# Altium schematic sheet On_Off.SchDoc: ON / OFF Controller
size A3; DocumentNumber: 3; SheetNumber: 3; SheetTotal: 20
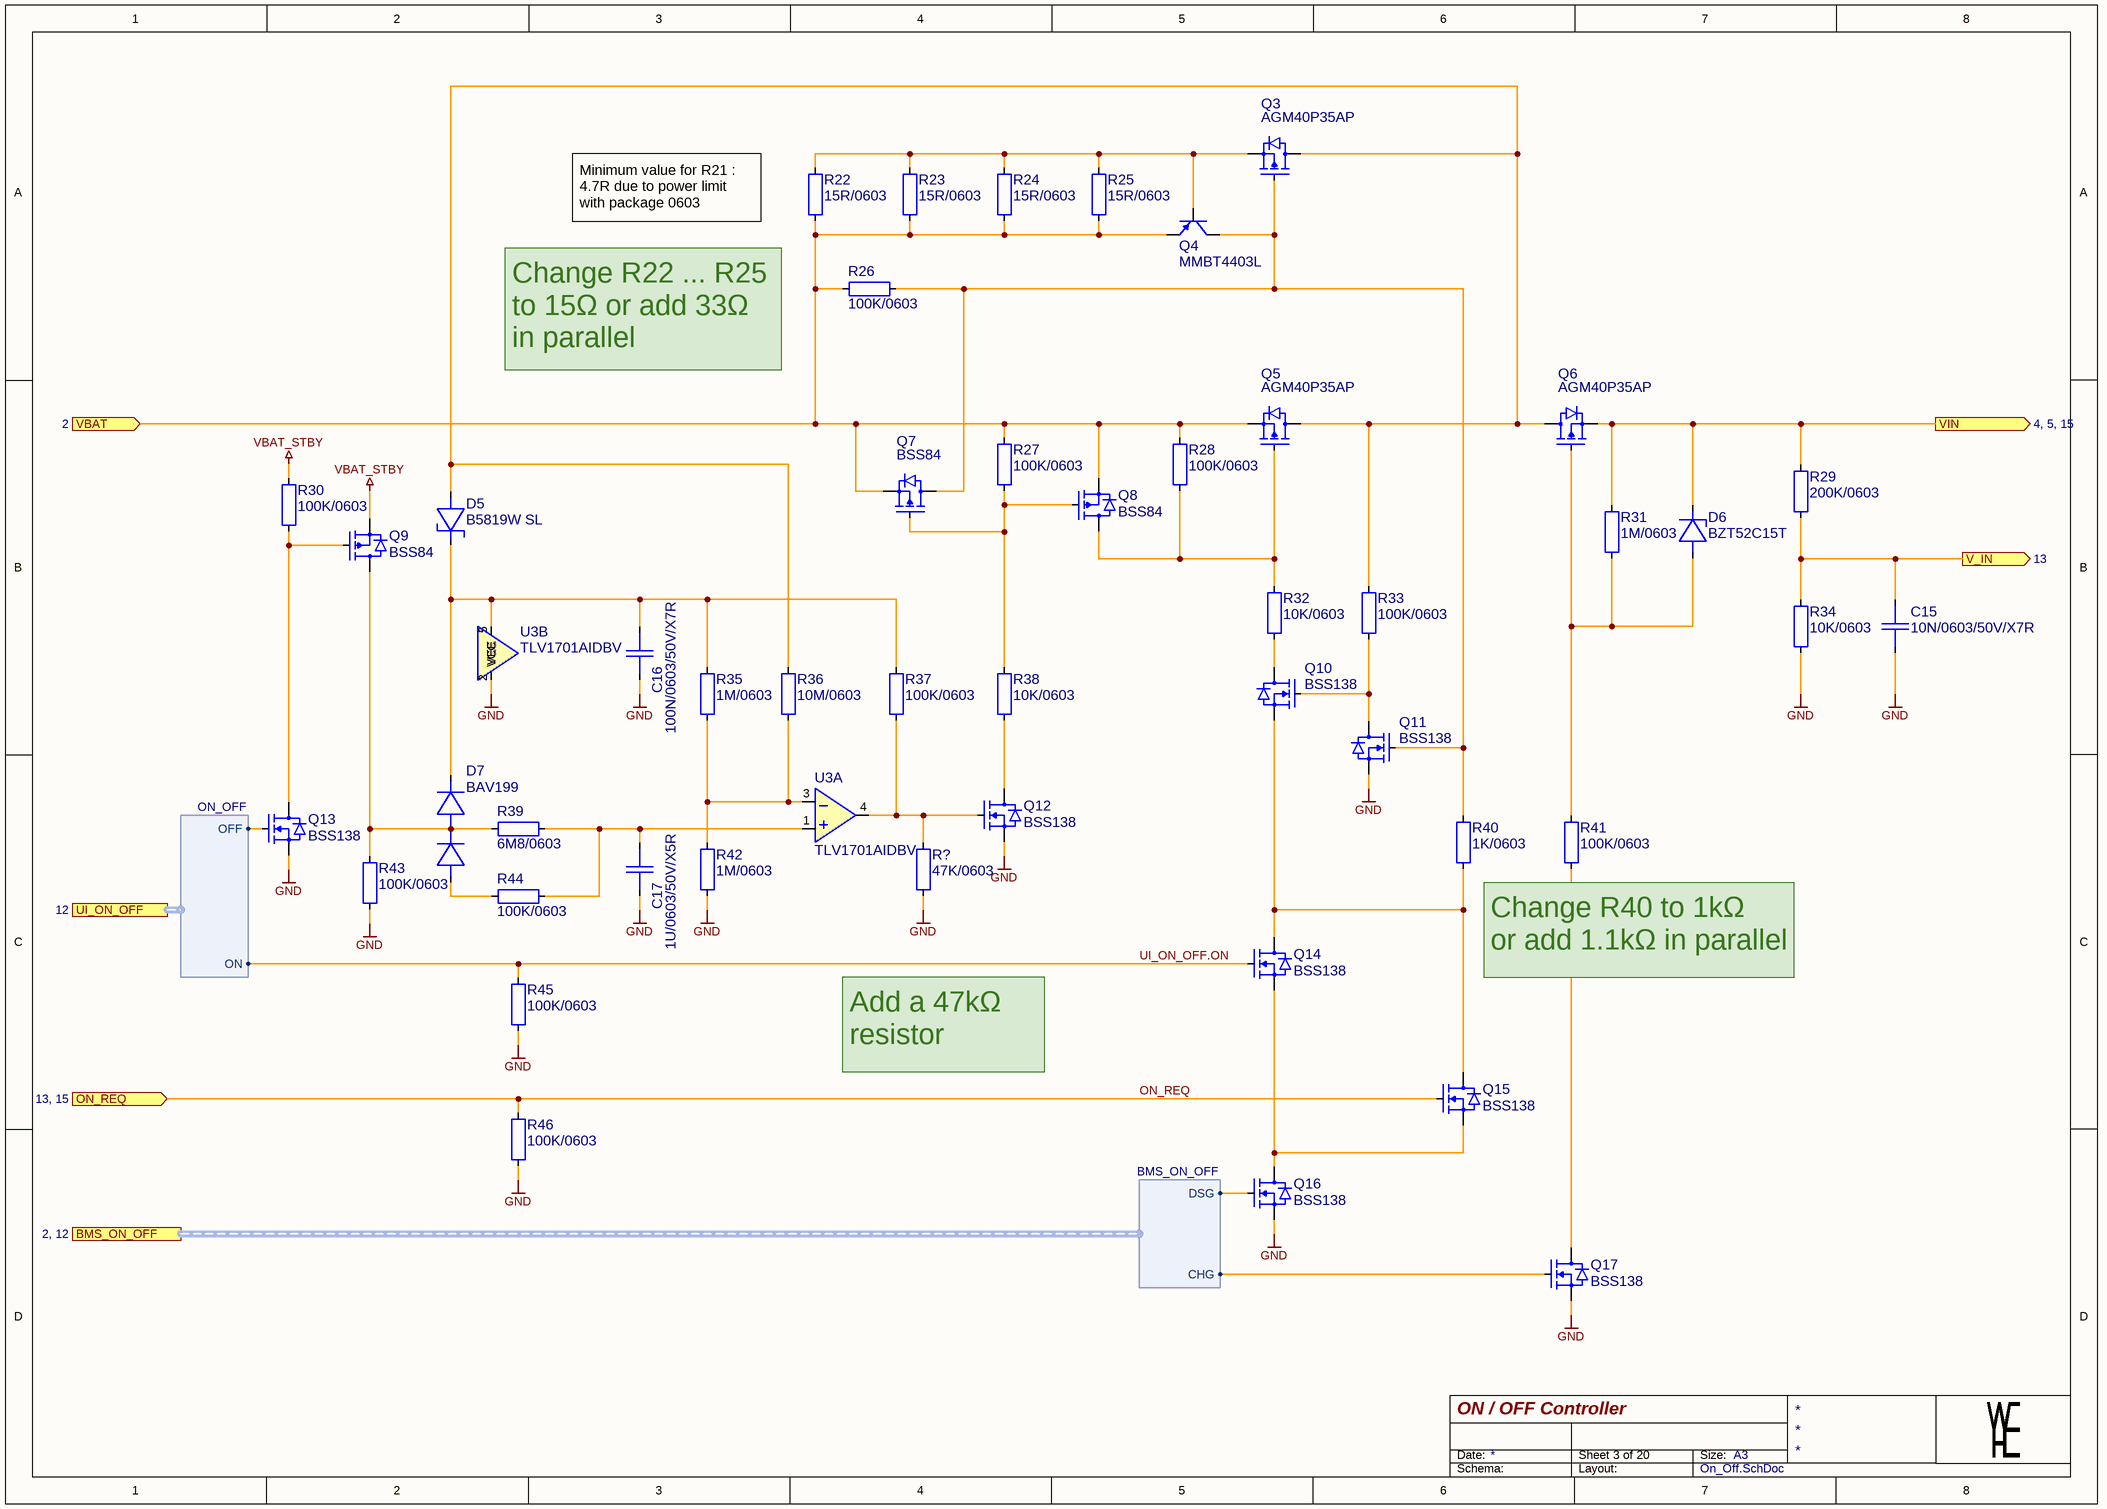
[diagram p0: On_Off.SchDoc]

## Parts
C15  10N/0603/50V/X7R  [CAP0603_X7R]
C16  100N/0603/50V/X7R  [CAP0603_X7R]
C17  1U/0603/50V/X5R  [CAP0603_X7R]
D5  B5819W SL  [SOD3718X125]
D6  BZT52C15T  [SOD1608X065]
D7  BAV199  [SOT2395P280X125-3-SE]
Q3  AGM40P35AP  [SON065P330X330X075-5-TH245X175]
Q4  MMBT4403L  [SOT2395P280X125-3-SE]
Q5  AGM40P35AP  [SON065P330X330X075-5-TH245X175]
Q6  AGM40P35AP  [SON065P330X330X075-5-TH245X175]
Q7  BSS84  [SOT2395P280X125-3-SE]
Q8  BSS84  [SOT2395P280X125-3-SE]
Q9  BSS84  [SOT2395P280X125-3-SE]
Q10  BSS138  [SOT2395P280X125-3-SE]
Q11  BSS138  [SOT2395P280X125-3-SE]
Q12  BSS138  [SOT2395P280X125-3-SE]
Q13  BSS138  [SOT2395P280X125-3-SE]
Q14  BSS138  [SOT2395P280X125-3-SE]
Q15  BSS138  [SOT2395P280X125-3-SE]
Q16  BSS138  [SOT2395P280X125-3-SE]
Q17  BSS138  [SOT2395P280X125-3-SE]
R22  15R/0603  [R0603-0.40-WW]
R23  15R/0603  [R0603-0.40-WW]
R24  15R/0603  [R0603-0.40-WW]
R25  15R/0603  [R0603-0.40-WW]
R26  100K/0603  [R0603-0.40-WW]
R27  100K/0603  [R0603-0.40-WW]
R28  100K/0603  [R0603-0.40-WW]
R29  200K/0603  [R0603-0.40-WW]
R30  100K/0603  [R0603-0.40-WW]
R31  1M/0603  [R0603-0.40-WW]
R32  10K/0603  [R0603-0.40-WW]
R33  100K/0603  [R0603-0.40-WW]
R34  10K/0603  [R0603-0.40-WW]
R35  1M/0603  [R0603-0.40-WW]
R36  10M/0603  [R0603-0.40-WW]
R37  100K/0603  [R0603-0.40-WW]
R38  10K/0603  [R0603-0.40-WW]
R39  6M8/0603  [R0603-0.40-WW]
R40  1K/0603  [R0603-0.40-WW]
R41  100K/0603  [R0603-0.40-WW]
R42  1M/0603  [R0603-0.40-WW]
R43  100K/0603  [R0603-0.40-WW]
R44  100K/0603  [R0603-0.40-WW]
R45  100K/0603  [R0603-0.40-WW]
R46  100K/0603  [R0603-0.40-WW]
R?  47K/0603  [R0603-0.40-WW]
U3  TLV1701AIDBV  [SOT2395P280X125-5-NW]  (parts A,B of 2)

## Ports
BMS_ON_OFF (harness BMS_ON_OFF, see 2, 12), ON_REQ (in, see 13, 15), UI_ON_OFF (harness ON_OFF, see 12), V_IN (out, see 13), VBAT (in, see 2), VIN (out, see 4, 5, 15)

## Harnesses
ON_OFF: OFF, ON
BMS_ON_OFF: CHG, DSG

## Nets
GND: C15.2 C16.2 C17.2 Q11.2(SOURCE) Q12.2(SOURCE) Q13.2(SOURCE) Q16.2(SOURCE) Q17.2(SOURCE) R34.2 R42.2 R43.2 R45.2 R46.2 R?.2 U3.2(VEE)
VBAT_STBY: Q9.2(SOURCE) R30.1
ON_REQ: Q15.1(GATE) R46.1 ; port ON_REQ
UI_ON_OFF.ON: Q14.1(GATE) R45.1 ; port UI_ON_OFF.ON
V_IN: C15.1 R29.2 R34.1 ; port V_IN
VBAT: Q4.2(EMITTER) Q5.1,2,3(SOURCE) Q7.2(SOURCE) Q8.2(SOURCE) R22.1 R23.1 R24.1 R25.1 R26.1 R27.1 R28.1 ; port VBAT
VIN: D6.1(C) Q6.1,2,3(SOURCE) R29.1 R31.1 ; port VIN
NetC16_1: C16.1 D5.1(C) D7.2(K2) R35.1 R37.1 U3.5(VCC)
NetC17_1: C17.1 R39.2 R44.2 U3.1(IN+)
NetD5_2: D5.2(A) Q3.5(DRAIN) Q5.5(DRAIN) Q6.5(DRAIN) R33.1 R36.1
NetD6_2: D6.2(A) Q6.4(GATE) R31.2 R41.1
NetD7_1: D7.1(A1) R44.1
NetD7_3: D7.3(K1/A2) Q9.3(DRAIN) R39.1 R43.1
NetQ3_1,2,3: Q3.1,2,3(SOURCE) Q4.1(BASE) R22.2 R23.2 R24.2 R25.2
NetQ3_4: Q3.4(GATE) Q4.3(COLLECTOR) Q7.3(DRAIN) Q11.1(GATE) R26.2 R40.1
NetQ5_4: Q5.4(GATE) Q8.3(DRAIN) R28.2 R32.1
NetQ7_1: Q7.1(GATE) Q8.1(GATE) R27.2 R38.1
NetQ9_1: Q9.1(GATE) Q13.3(DRAIN) R30.2
NetQ10_1: Q10.1(GATE) Q11.3(DRAIN) R33.2
NetQ10_2: Q10.2(SOURCE) Q14.3(DRAIN) Q15.3(DRAIN) R40.2
NetQ10_3: Q10.3(DRAIN) R32.2
NetQ12_1: Q12.1(GATE) R37.2 R?.1 U3.4(OUT)
NetQ12_3: Q12.3(DRAIN) R38.2
NetQ13_1: Q13.1(GATE) ; port UI_ON_OFF.OFF
NetQ14_2: Q14.2(SOURCE) Q15.2(SOURCE) Q16.3(DRAIN)
NetQ16_1: Q16.1(GATE) ; port BMS_ON_OFF.DSG
NetQ17_1: Q17.1(GATE) ; port BMS_ON_OFF.CHG
NetQ17_3: Q17.3(DRAIN) R41.2
NetR35_2: R35.2 R36.2 R42.1 U3.3(IN-)

## Notes on the sheet
- Minimum value for R21 :
  4.7R due to power limit with package 0603
- Change R22 ... R25 to 15Ω or add 33Ω in parallel
- Change R40 to 1kΩ
  or add 1.1kΩ in parallel
- Add a 47kΩ resistor
- Date:
- Size:
- A3
- Schema:
- Layout:

## Library data of the parts
C15 = 10N/0603/50V/X7R: CAP SM 0603 10nF 50V X7R; Manufacturer: GENERIC; Manufacturer 1: YAGEO; Manufacturer Part Number 1: CC0603KPX7R9BB103; Absolute Value: 1E-8; Eurocircuits GPN: GPC0603103; Part Number: 10N/0603/50V/X7R; Package: 0603; Value: 10nF; HelpURL: https://www.yageo.com/upload/media/product/app/datasheet/mlcc/upy-gphc_x7r_6_3v-to-250v.pdf; Supplier 1: Digi-Key; Supplier Part Number 1: 311-1572-1-ND; Manufacturer 2: YAGEO; Manufacturer Part Number 2: CC0603KRX7R9BB103; Supplier 2: Digi-Key; Supplier Part Number 2: 311-1085-1-ND; Manufacturer Part Number 3: CC0603KRX7R9BB103; Supplier 3: LCSC; Supplier Part Number 3: C100042
C16 = 100N/0603/50V/X7R: CAP SM 0603 100nF 50V X7R; Manufacturer: GENERIC; Manufacturer 1: YAGEO; Manufacturer Part Number 1: CC0603KPX7R9BB104; Absolute Value: 1E-7; Eurocircuits GPN: GPC0603104; Part Number: 100N/0603/50V/X7R; Package: 0603; Value: 100nF; HelpURL: https://www.yageo.com/upload/media/product/app/datasheet/mlcc/upy-gphc_x7r_6_3v-to-250v.pdf; Supplier 1: Digi-Key; Supplier Part Number 1: 311-3567-1-ND; Supplier 3: LCSC; Supplier Part Number 3: C14663; Manufacturer 2: YAGEO; Manufacturer Part Number 2: CC0603MRX7R9BB104; Supplier 2: Digi-Key; Supplier Part Number 2: 311-4110-1-ND; JLC Type: Basic; Manufacturer Part Number 3: CC0603KRX7R9BB104
C17 = 1U/0603/50V/X5R: CAP SM 0603 1.0uF 50V X5R; Manufacturer: GENERIC; Manufacturer 1: Samsung Electro-Mechanics; Manufacturer Part Number 1: CL10A105KB8NNNC; Absolute Value: 1E-6; Eurocircuits GPN: GPC0603105-X5R; Part Number: 1U/0603/50V/X5R; Package: 0603; Value: 1.0uF; HelpURL: https://mm.digikey.com/Volume0/opasdata/d220001/medias/docus/658/CL10A105KB8NNNC_Spec.pdf; Supplier 1: Digi-Key; Supplier Part Number 1: 1276-1860-1-ND; Manufacturer Part Number 3: CL10A105KB8NNNC; Supplier 3: LCSC; Supplier Part Number 3: C15849; JLC Type: Basic
D5 = B5819W SL: 40V 600mV@1A 1A SOD-123 Schottky Barrier Diodes; Manufacturer: GENERIC; Manufacturer 1: SMC Diode Solutions; Part Number: B5819W SL; Package: SOD-123; Value: B5819W SL; Absolute Value: 40V; HelpURL: https://datasheet.lcsc.com/lcsc/2304140030_Jiangsu-Changjing-Electronics-Technology-Co---Ltd--B5819W-SL_C8598.pdf; Manufacturer 3: Jiangsu Changjing Electronics Technology Co., Ltd.; Manufacturer Part Number 3: B5819W SL; Supplier 3: LCSC; Supplier Part Number 3: C8598; JLC Type: Basic; Manufacturer Part Number 1: B5819WSL; Supplier 1: Digikey; Supplier Part Number 1: 1655-B5819WSLCT-ND
D6 = BZT52C15T: DIODE ZENER 15V 100MW SOD523; Manufacturer: Micro Commercial Co; Manufacturer Part Number 1: BZT52C15T-TP; Part Number: BZT52C15T; Package: SC-79, SOD-523; Value: BZT52C15T; Absolute Value: 15 V; HelpURL: https://www.mccsemi.com/pdf/Products/BZT52C(B)2V4T-BZT52C(B)39T(SOD-523).pdf; Manufacturer 1: Micro Commercial Co; Supplier 1: Digikey; Supplier Part Number 1: BZT52C15T-TPMSCT-ND; Manufacturer 2: Diodes Incorporated; Manufacturer Part Number 2: BZT52C15T-7; Supplier 2: Digikey; Supplier Part Number 2: BZT52C15T-7DICT-ND; Manufacturer 3: Diodes Incorporated; Manufacturer Part Number 3: BZT52C15T-7; Supplier 3: LCSC; Supplier Part Number 3: C460787
D7 = BAV199: Silicon Low Leakage Diode 85V; Manufacturer: Infineon Technologies; Manufacturer Part Number 1: BAV199E6433HTMA1; Part Number: BAV199; Package: SOT23; Value: BAV199; Absolute Value: 85V; HelpURL: https://www.infineon.com/dgdl/bav199series.pdf?folderId=db3a30431400ef6801141c748874044e&fileId=db3a30431400ef6801141cba733104e5; Manufacturer 1: Infineon Technologies; Supplier 1: Digikey; Supplier Part Number 1: BAV199E6433HTMA1CT-ND; Manufacturer 3: LRC; Manufacturer Part Number 3: LBAV199LT1G; Supplier 3: LCSC; Supplier Part Number 3: C12740
Q3 Q5 Q6 = AGM40P35AP: 40V 35A 11mΩ@10V,15A 30W 1.7V 1 piece P-channel PDFN(3.3x3.3) MOSFETs ROHS; Manufacturer: AGM-Semi; Part Number: AGM40P35AP; Package: 8-PowerVDFN; HelpURL: https://www.lcsc.com/datasheet/lcsc_datasheet_2504101957_AGM-Semi-AGM40P35AP_C18221399.pdf; Manufacturer 3: AGM-Semi; Manufacturer Part Number 3: AGM40P35AP; Supplier 3: LCSC; Supplier Part Number 3: C18221399
Q4 = MMBT4403L: Switching Transistor PNP Silicon; Manufacturer: ON SEMI; Part Number: MMBT4403L; Package: SOT23; HelpURL: https://www.onsemi.com/pdf/datasheet/mmbt4403lt1-d.pdf; Manufacturer 3: ONSEMI; Manufacturer Part Number 3: MMBT4403LT1G; Supplier 3: LCSC; Supplier Part Number 3: C78864; JLC Type: Extended
Q7-Q9 = BSS84: 50V P-Channel MOSFET; Manufacturer: GENERIC; Manufacturer 1: Good-Ark Semiconductor; Part Number: BSS84; Package: SOT23; HelpURL: https://goodarksemi.com/docs/datasheets/mosfets/BSS84.pdf; Manufacturer Part Number 1: BSS84; Supplier 1: Digi-Key; Supplier Part Number 1: 4786-BSS84CT-ND; Manufacturer 3: Jiangsu Changjing Electronics Technology Co., Ltd.; Manufacturer Part Number 3: BSS84; Supplier 3: LCSC; Supplier Part Number 3: C114481; JLC Type: Extended; Manufacturer 2: LRC; Manufacturer Part Number 2: LBSS84LT1G; Supplier 2: LCSC; Supplier Part Number 2: C8492
Q10-Q17 = BSS138: N-Kanal 50 V 220mA (Ta) 350mW (Ta) Oberflächenmontage SOT-23; Manufacturer: GENERIC; Manufacturer 1: ANBON SEMICONDUCTOR (INT'L) LIMITED; Part Number: BSS138; Package: SOT23; HelpURL: https://mm.digikey.com/Volume0/opasdata/d220001/medias/docus/3037/BSS138.pdf; Manufacturer Part Number 1: BSS138; Supplier 1: Digi-Key; Supplier Part Number 1: 4530-BSS138CT-ND; Manufacturer 3: FOSAN; Manufacturer Part Number 3: BSS138; Supplier 3: LCSC; Supplier Part Number 3: C2926186; JLC Type: Extended; Manufacturer 2: FOSAN; Manufacturer Part Number 2: BSS138; Supplier 2: LCSC; Supplier Part Number 2: C2926186
R22-R25 = 15R/0603: RES SM 0603 15R; Manufacturer: GENERIC; Manufacturer 1: YAGEO; Manufacturer Part Number 1: RC0603FR-1315RL; Absolute Value: 15; Eurocircuits GPN: GPR060315R; Part Number: 15R/0603; Package: 0603; Value: 15R; HelpURL: https://www.yageogroup.com/content/datasheet/asset/file/PYU-RC_GROUP_51_ROHS_L; Supplier 1: Digi-Key; Supplier Part Number 1: 13-RC0603FR-1315RLCT-ND; Manufacturer 2: YAGEO; Manufacturer Part Number 2: RC0603FR-1015RL; Supplier 2: Digi-Key; Supplier Part Number 2: 13-RC0603FR-1015RLCT-ND
R26-R28 R30 R33 R37 R41 R43-R46 = 100K/0603: RES SM 0603 100K; Manufacturer: GENERIC; Manufacturer 1: YAGEO; Manufacturer Part Number 1: RC0603FR-13100KL; Absolute Value: 100000; Eurocircuits GPN: GPR0603100K; Part Number: 100K/0603; Package: 0603; Value: 100K; HelpURL: https://www.yageogroup.com/content/datasheet/asset/file/PYU-RC_GROUP_51_ROHS_L; Supplier 1: Digi-Key; Supplier Part Number 1: 13-RC0603FR-13100KLCT-ND; Manufacturer 2: YAGEO; Manufacturer Part Number 2: RC0603FR-10100KL; Supplier 2: Digi-Key; Supplier Part Number 2: 13-RC0603FR-10100KLCT-ND; Manufacturer 3: UNI-ROYAL(Uniroyal Elec); Manufacturer Part Number 3: 0603WAF1003T5E; Supplier 3: LCSC; Supplier Part Number 3: C25803; JLC Type: Basic
R29 = 200K/0603: RES SM 0603 200K; Manufacturer: GENERIC; Manufacturer 1: YAGEO; Manufacturer Part Number 1: RC0603FR-13200KL; Absolute Value: 200000; Eurocircuits GPN: GPR0603200K; Part Number: 200K/0603; Package: 0603; Value: 200K; HelpURL: https://www.yageogroup.com/content/datasheet/asset/file/PYU-RC_GROUP_51_ROHS_L; Supplier 1: Digi-Key; Supplier Part Number 1: 13-RC0603FR-13200KLCT-ND; Manufacturer 2: YAGEO; Manufacturer Part Number 2: RC0603FR-10200KL; Supplier 2: Digi-Key; Supplier Part Number 2: 13-RC0603FR-10200KLCT-ND; JLC Type: Basic; Manufacturer 3: UNI-ROYAL(Uniroyal Elec); Manufacturer Part Number 3: 0603WAF2003T5E; Supplier 3: LCSC; Supplier Part Number 3: C25811
R31 R35 R42 = 1M/0603: RES SM 0603 1M; Manufacturer: GENERIC; Manufacturer 1: YAGEO; Manufacturer Part Number 1: RC0603FR-131ML; Absolute Value: 1000000; Eurocircuits GPN: GPR06031M; Part Number: 1M/0603; Package: 0603; Value: 1M; HelpURL: https://www.yageogroup.com/content/datasheet/asset/file/PYU-RC_GROUP_51_ROHS_L; Supplier 1: Digi-Key; Supplier Part Number 1: 13-RC0603FR-131MLCT-ND; Manufacturer 2: YAGEO; Manufacturer Part Number 2: RC0603FR-101ML; Supplier 2: Digi-Key; Supplier Part Number 2: 13-RC0603FR-101MLCT-ND; Manufacturer 3: UNI-ROYAL(Uniroyal Elec); Manufacturer Part Number 3: 0603WAF1004T5E; Supplier 3: LCSC; Supplier Part Number 3: C22935; JLC Type: Basic
R32 R34 R38 = 10K/0603: RES SM 0603 10K; Manufacturer: GENERIC; Manufacturer 1: YAGEO; Manufacturer Part Number 1: RC0603FR-1310KL; Absolute Value: 10000; Eurocircuits GPN: GPR060310K; Part Number: 10K/0603; Package: 0603; Value: 10K; HelpURL: https://www.yageogroup.com/content/datasheet/asset/file/PYU-RC_GROUP_51_ROHS_L; Supplier 1: Digi-Key; Supplier Part Number 1: 13-RC0603FR-1310KLCT-ND; Manufacturer 2: YAGEO; Manufacturer Part Number 2: RC0603FR-1010KL; Supplier 2: Digi-Key; Supplier Part Number 2: 13-RC0603FR-1010KLCT-ND; Manufacturer 3: UNI-ROYAL(Uniroyal Elec); Manufacturer Part Number 3: 0603WAF1002T5E; Supplier 3: LCSC; Supplier Part Number 3: C25804; JLC Type: Basic
R36 = 10M/0603: RES SM 0603 10M; Manufacturer: GENERIC; Manufacturer 1: YAGEO; Manufacturer Part Number 1: RC0603FR-1310ML; Absolute Value: 10000000; Eurocircuits GPN: GPR060310M; Part Number: 10M/0603; Package: 0603; Value: 10M; HelpURL: https://www.yageogroup.com/content/datasheet/asset/file/PYU-RC_GROUP_51_ROHS_L; Supplier 1: Digi-Key; Supplier Part Number 1: 13-RC0603FR-1310MLCT-ND; Manufacturer 2: YAGEO; Manufacturer Part Number 2: RC0603FR-1010ML; Supplier 2: Digi-Key; Supplier Part Number 2: 13-RC0603FR-1010MLCT-ND; Manufacturer 3: UNI-ROYAL(Uniroyal Elec); Manufacturer Part Number 3: 0603WAF1005T5E; Supplier 3: LCSC; Supplier Part Number 3: C7250; JLC Type: Basic
R39 = 6M8/0603: RES SM 0603 6M8; Manufacturer: GENERIC; Manufacturer 1: YAGEO; Manufacturer Part Number 1: RC0603FR-076M8L; Absolute Value: 6800000; Eurocircuits GPN: GPR06036M8; Part Number: 6M8/0603; Package: 0603; Value: 6M8; HelpURL: https://www.yageogroup.com/content/datasheet/asset/file/PYU-RC_GROUP_51_ROHS_L; Supplier 1: Digi-Key; Supplier Part Number 1: 13-RC0603FR-076M8LCT-ND; JLC Type: Extended; Manufacturer 3: FOJAN; Manufacturer Part Number 3: FRC0603F6804TS; Supplier 3: LCSC; Supplier Part Number 3: C3013205
R40 = 1K/0603: RES SM 0603 1K; Manufacturer: GENERIC; Manufacturer 1: YAGEO; Manufacturer Part Number 1: RC0603FR-131KL; Absolute Value: 1000; Eurocircuits GPN: GPR06031K; Part Number: 1K/0603; Package: 0603; Value: 1K; HelpURL: https://www.yageogroup.com/content/datasheet/asset/file/PYU-RC_GROUP_51_ROHS_L; Supplier 1: Digi-Key; Supplier Part Number 1: 13-RC0603FR-131KLCT-ND; Manufacturer 2: YAGEO; Manufacturer Part Number 2: RC0603FR-101KL; Supplier 2: Digi-Key; Supplier Part Number 2: 13-RC0603FR-101KLCT-ND; Manufacturer 3: UNI-ROYAL(Uniroyal Elec); Manufacturer Part Number 3: 0603WAF1001T5E; Supplier 3: LCSC; Supplier Part Number 3: C21190; JLC Type: Basic
R? = 47K/0603: RES SM 0603 47K; Manufacturer: GENERIC; Manufacturer 1: YAGEO; Manufacturer Part Number 1: RC0603FR-1347KL; Absolute Value: 47000; Eurocircuits GPN: GPR060347K; Part Number: 47K/0603; Package: 0603; Value: 47K; HelpURL: https://www.yageogroup.com/content/datasheet/asset/file/PYU-RC_GROUP_51_ROHS_L; Supplier 1: Digi-Key; Supplier Part Number 1: 13-RC0603FR-1347KLCT-ND; Manufacturer 2: YAGEO; Manufacturer Part Number 2: RC0603FR-1047KL; Supplier 2: Digi-Key; Supplier Part Number 2: 13-RC0603FR-1047KLCT-ND; Manufacturer 3: UNI-ROYAL(Uniroyal Elec); Manufacturer Part Number 3: 0603WAF4702T5E; Supplier 3: LCSC; Supplier Part Number 3: C25819; JLC Type: Basic
U3 = TLV1701 SOT23: TLV1701 2.2-V to 36-V, microPower Comparato; Manufacturer: Texas Instruments; Manufacturer Part Number 1: TLV1701AIDBVR; Part Number: TLV1701 SOT23; Package: SOT23-5; HelpURL: https://www.ti.com/lit/ds/symlink/tlv1701.pdf; Manufacturer 1: Texas Instruments; Supplier 1: Digi-Key; Supplier Part Number 1: 296-40599-1-ND; Manufacturer 3: Texas Instruments; Manufacturer Part Number 3: TLV1701AIDBVR; Supplier 3: LCSC; Supplier Part Number 3: C130035; Manufacturer 2: Texas Instruments; Manufacturer Part Number 2: TLV1701QDBVRQ1; Supplier 2: Digi-Key; Supplier Part Number 2: 296-47458-1-ND